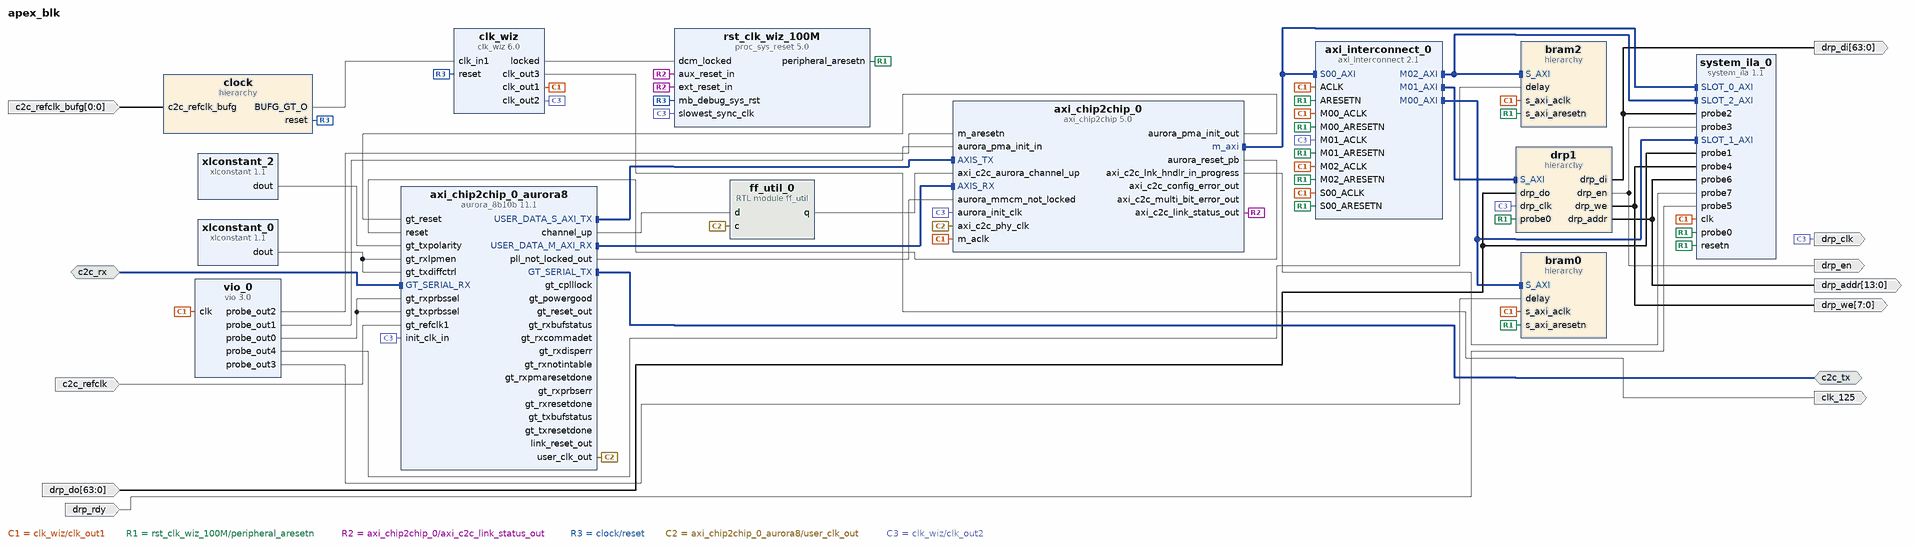
[diagram p0: block diagram of the top level]
# Vivado block design apex_blk, xcku15p-ffva1760-2-e, Vivado 2020.1
create_bd_design apex_blk

create_bd_intf_port -mode Master -vlnv xilinx.com:display_aurora:GT_Serial_Transceiver_Pins_TX_rtl:1.0 c2c_tx
create_bd_intf_port -mode Slave -vlnv xilinx.com:display_aurora:GT_Serial_Transceiver_Pins_RX_rtl:1.0 c2c_rx
create_bd_port -dir O -type clk drp_clk
create_bd_port -dir I -type clk c2c_refclk
set_property -dict {CONFIG.FREQ_HZ 250000000} [get_bd_ports c2c_refclk]
create_bd_port -dir I -from 0 -to 0 -type clk c2c_refclk_bufg
set_property -dict {CONFIG.FREQ_HZ 250000000} [get_bd_ports c2c_refclk_bufg]
create_bd_port -dir I -from 63 -to 0 drp_do
create_bd_port -dir O -from 63 -to 0 drp_di
create_bd_port -dir O drp_en
create_bd_port -dir O -from 7 -to 0 drp_we
create_bd_port -dir I drp_rdy
create_bd_port -dir O -from 13 -to 0 drp_addr
create_bd_port -dir O -type clk clk_125
set_property -dict {CONFIG.FREQ_HZ 125000000} [get_bd_ports clk_125]

create_bd_cell -type ip -vlnv xilinx.com:ip:axi_interconnect:2.1 axi_interconnect_0
set_property -dict {CONFIG.NUM_MI 3} [get_bd_cells axi_interconnect_0]
create_bd_cell -type ip -vlnv xilinx.com:ip:axi_chip2chip:5.0 axi_chip2chip_0
set_property -dict [list \
  CONFIG.C_ECC_ENABLE false \
  CONFIG.C_EN_AXI_LINK_HNDLR true \
  CONFIG.C_INTERFACE_MODE 1 \
  CONFIG.C_INTERFACE_TYPE 3 \
  CONFIG.C_MASTER_FPGA 0 \
  CONFIG.C_M_AXI_WUSER_WIDTH 0 \
] [get_bd_cells axi_chip2chip_0]
create_bd_cell -type ip -vlnv xilinx.com:ip:aurora_8b10b:11.1 axi_chip2chip_0_aurora8
set_property -dict [list \
  CONFIG.CHANNEL_ENABLE X0Y12 \
  CONFIG.C_AURORA_LANES 1 \
  CONFIG.C_DRP_IF false \
  CONFIG.C_LANE_WIDTH 4 \
  CONFIG.C_LINE_RATE 3.75 \
  CONFIG.C_REFCLK_FREQUENCY 250 \
  CONFIG.C_REFCLK_SOURCE {MGTREFCLK0 of Quad X0Y3} \
  CONFIG.C_START_LANE X0Y12 \
  CONFIG.C_START_QUAD Quad_X0Y3 \
  CONFIG.Interface_Mode Streaming \
  CONFIG.RX_EQ_MODE LPM \
  CONFIG.SINGLEEND_GTREFCLK true \
  CONFIG.SupportLevel 1 \
  CONFIG.TransceiverControl true \
] [get_bd_cells axi_chip2chip_0_aurora8]
create_bd_cell -type ip -vlnv xilinx.com:ip:vio:3.0 vio_0
set_property -dict [list \
  CONFIG.C_NUM_PROBE_IN 0 \
  CONFIG.C_NUM_PROBE_OUT 5 \
  CONFIG.C_PROBE_OUT0_WIDTH 4 \
  CONFIG.C_PROBE_OUT2_INIT_VAL 0x1 \
  CONFIG.C_PROBE_OUT3_INIT_VAL 0x11 \
  CONFIG.C_PROBE_OUT3_WIDTH 7 \
  CONFIG.C_PROBE_OUT4_INIT_VAL 0x61 \
  CONFIG.C_PROBE_OUT4_WIDTH 7 \
] [get_bd_cells vio_0]
create_bd_cell -type ip -vlnv xilinx.com:ip:proc_sys_reset:5.0 rst_clk_wiz_100M
create_bd_cell -type ip -vlnv xilinx.com:ip:xlconstant:1.1 xlconstant_2
set_property -dict {CONFIG.CONST_VAL 0} [get_bd_cells xlconstant_2]
create_bd_cell -type module -reference ff_util ff_util_0
create_bd_cell -type ip -vlnv xilinx.com:ip:xlconstant:1.1 xlconstant_0
set_property -dict {CONFIG.CONST_VAL 31 CONFIG.CONST_WIDTH 5} [get_bd_cells xlconstant_0]
create_bd_cell -type hier bram0
create_bd_cell -type hier bram2
create_bd_cell -type hier drp1
create_bd_cell -type hier clock
create_bd_cell -type ip -vlnv xilinx.com:ip:clk_wiz:6.0 clk_wiz
set_property -dict [list \
  CONFIG.CLKIN1_JITTER_PS 40.0 \
  CONFIG.CLKOUT1_JITTER 102.484 \
  CONFIG.CLKOUT1_PHASE_ERROR 79.008 \
  CONFIG.CLKOUT2_JITTER 117.522 \
  CONFIG.CLKOUT2_PHASE_ERROR 79.008 \
  CONFIG.CLKOUT2_REQUESTED_OUT_FREQ 50 \
  CONFIG.CLKOUT2_USED true \
  CONFIG.CLKOUT3_JITTER 98.122 \
  CONFIG.CLKOUT3_PHASE_ERROR 79.008 \
  CONFIG.CLKOUT3_REQUESTED_OUT_FREQ 125.000 \
  CONFIG.CLKOUT3_USED true \
  CONFIG.MMCM_CLKFBOUT_MULT_F 5.000 \
  CONFIG.MMCM_CLKIN1_PERIOD 4.000 \
  CONFIG.MMCM_CLKOUT0_DIVIDE_F 12.500 \
  CONFIG.MMCM_CLKOUT1_DIVIDE 25 \
  CONFIG.MMCM_CLKOUT2_DIVIDE 10 \
  CONFIG.MMCM_DIVCLK_DIVIDE 1 \
  CONFIG.NUM_OUT_CLKS 3 \
  CONFIG.PRIM_IN_FREQ 250 \
] [get_bd_cells clk_wiz]
create_bd_cell -type ip -vlnv xilinx.com:ip:system_ila:1.1 system_ila_0
set_property -dict [list \
  CONFIG.C_INPUT_PIPE_STAGES 6 \
  CONFIG.C_MON_TYPE MIX \
  CONFIG.C_NUM_MONITOR_SLOTS 3 \
  CONFIG.C_NUM_OF_PROBES 8 \
] [get_bd_cells system_ila_0]

# ---- hierarchy /bram0 ----
current_bd_instance /bram0
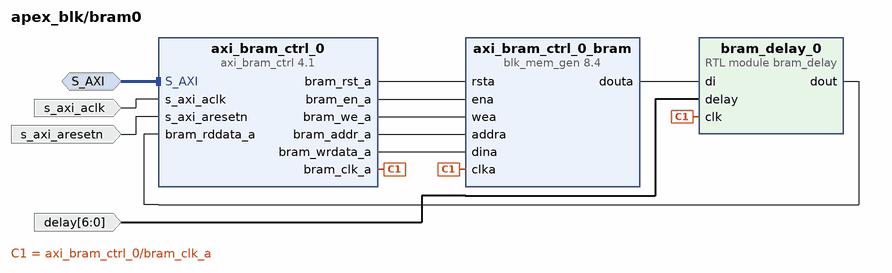
[diagram p1: block diagram inside /bram0]
create_bd_intf_pin -mode Slave -vlnv xilinx.com:interface:aximm_rtl:1.0 S_AXI
create_bd_pin -dir I -type clk s_axi_aclk
create_bd_pin -dir I -type rst s_axi_aresetn
create_bd_pin -dir I -from 6 -to 0 delay

create_bd_cell -type ip -vlnv xilinx.com:ip:axi_bram_ctrl:4.1 axi_bram_ctrl_0
set_property -dict {CONFIG.READ_LATENCY 20 CONFIG.SINGLE_PORT_BRAM 1} [get_bd_cells axi_bram_ctrl_0]
create_bd_cell -type module -reference bram_delay bram_delay_0
create_bd_cell -type ip -vlnv xilinx.com:ip:blk_mem_gen:8.4 axi_bram_ctrl_0_bram
set_property -dict [list \
  CONFIG.Memory_Type Single_Port_RAM \
  CONFIG.Port_B_Clock 0 \
  CONFIG.Port_B_Enable_Rate 0 \
  CONFIG.Port_B_Write_Rate 0 \
] [get_bd_cells axi_bram_ctrl_0_bram]

# ---- hierarchy /bram2 ----
current_bd_instance /bram2
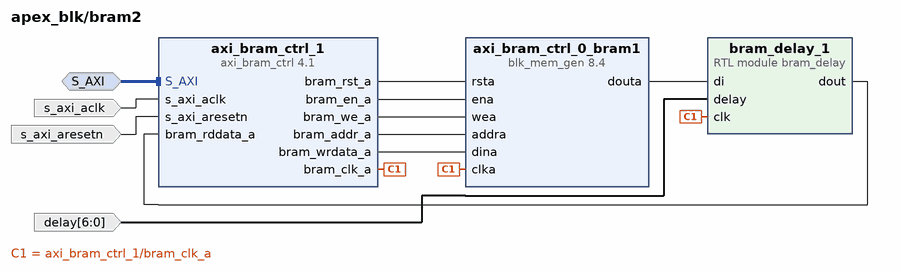
[diagram p2: block diagram inside /bram2]
create_bd_intf_pin -mode Slave -vlnv xilinx.com:interface:aximm_rtl:1.0 S_AXI
create_bd_pin -dir I -type clk s_axi_aclk
create_bd_pin -dir I -type rst s_axi_aresetn
create_bd_pin -dir I -from 6 -to 0 delay

create_bd_cell -type ip -vlnv xilinx.com:ip:axi_bram_ctrl:4.1 axi_bram_ctrl_1
set_property -dict {CONFIG.READ_LATENCY 100 CONFIG.SINGLE_PORT_BRAM 1} [get_bd_cells axi_bram_ctrl_1]
create_bd_cell -type module -reference bram_delay bram_delay_1
create_bd_cell -type ip -vlnv xilinx.com:ip:blk_mem_gen:8.4 axi_bram_ctrl_0_bram1

# ---- hierarchy /drp1 ----
current_bd_instance /drp1
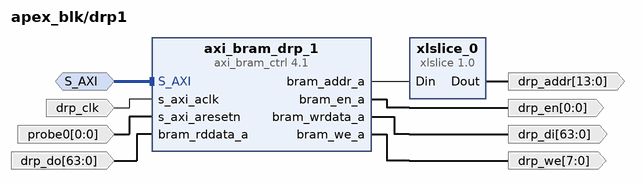
[diagram p3: block diagram inside /drp1]
create_bd_intf_pin -mode Slave -vlnv xilinx.com:interface:aximm_rtl:1.0 S_AXI
create_bd_pin -dir I -type clk drp_clk
create_bd_pin -dir I -from 0 -to 0 probe0
create_bd_pin -dir O -from 0 -to 0 drp_en
create_bd_pin -dir O -from 7 -to 0 drp_we
create_bd_pin -dir O -from 13 -to 0 drp_addr
create_bd_pin -dir O -from 63 -to 0 drp_di
create_bd_pin -dir I -from 63 -to 0 drp_do

create_bd_cell -type ip -vlnv xilinx.com:ip:axi_bram_ctrl:4.1 axi_bram_drp_1
set_property -dict {CONFIG.DATA_WIDTH 64 CONFIG.READ_LATENCY 20 CONFIG.SINGLE_PORT_BRAM 1} [get_bd_cells axi_bram_drp_1]
create_bd_cell -type ip -vlnv xilinx.com:ip:xlslice:1.0 xlslice_0
set_property -dict {CONFIG.DIN_FROM 16 CONFIG.DIN_TO 3 CONFIG.DIN_WIDTH 17 CONFIG.DOUT_WIDTH 14} [get_bd_cells xlslice_0]

# ---- hierarchy /clock ----
current_bd_instance /clock
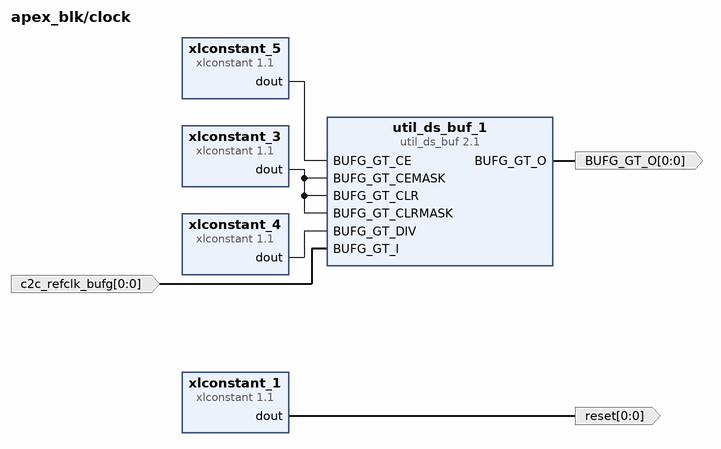
[diagram p4: block diagram inside /clock]
create_bd_pin -dir I -from 0 -to 0 -type clk c2c_refclk_bufg
create_bd_pin -dir O -from 0 -to 0 -type rst reset
create_bd_pin -dir O -from 0 -to 0 -type clk BUFG_GT_O

create_bd_cell -type ip -vlnv xilinx.com:ip:util_ds_buf:2.1 util_ds_buf_1
set_property -dict {CONFIG.C_BUF_TYPE BUFG_GT} [get_bd_cells util_ds_buf_1]
create_bd_cell -type ip -vlnv xilinx.com:ip:xlconstant:1.1 xlconstant_1
set_property -dict {CONFIG.CONST_VAL 0} [get_bd_cells xlconstant_1]
create_bd_cell -type ip -vlnv xilinx.com:ip:xlconstant:1.1 xlconstant_3
set_property -dict {CONFIG.CONST_VAL 0} [get_bd_cells xlconstant_3]
create_bd_cell -type ip -vlnv xilinx.com:ip:xlconstant:1.1 xlconstant_4
set_property -dict {CONFIG.CONST_VAL 0 CONFIG.CONST_WIDTH 3} [get_bd_cells xlconstant_4]
create_bd_cell -type ip -vlnv xilinx.com:ip:xlconstant:1.1 xlconstant_5

# ---- connections ----

current_bd_instance /bram0
connect_bd_intf_net -intf_net axi_interconnect_0_M00_AXI [get_bd_intf_pins S_AXI] [get_bd_intf_pins axi_bram_ctrl_0/S_AXI]
connect_bd_net [get_bd_pins axi_bram_ctrl_0/bram_rst_a] [get_bd_pins axi_bram_ctrl_0_bram/rsta]
connect_bd_net [get_bd_pins axi_bram_ctrl_0/bram_clk_a] [get_bd_pins axi_bram_ctrl_0_bram/clka] [get_bd_pins bram_delay_0/clk]
connect_bd_net [get_bd_pins axi_bram_ctrl_0/bram_en_a] [get_bd_pins axi_bram_ctrl_0_bram/ena]
connect_bd_net [get_bd_pins axi_bram_ctrl_0/bram_we_a] [get_bd_pins axi_bram_ctrl_0_bram/wea]
connect_bd_net [get_bd_pins axi_bram_ctrl_0/bram_addr_a] [get_bd_pins axi_bram_ctrl_0_bram/addra]
connect_bd_net [get_bd_pins axi_bram_ctrl_0/bram_wrdata_a] [get_bd_pins axi_bram_ctrl_0_bram/dina]
connect_bd_net [get_bd_pins bram_delay_0/dout] [get_bd_pins axi_bram_ctrl_0/bram_rddata_a]
connect_bd_net [get_bd_pins axi_bram_ctrl_0_bram/douta] [get_bd_pins bram_delay_0/di]
connect_bd_net -net clk_wiz_clk_out1 [get_bd_pins s_axi_aclk] [get_bd_pins axi_bram_ctrl_0/s_axi_aclk]
connect_bd_net -net rst_clk_wiz_100M_peripheral_aresetn [get_bd_pins s_axi_aresetn] [get_bd_pins axi_bram_ctrl_0/s_axi_aresetn]
connect_bd_net -net vio_0_probe_out3 [get_bd_pins delay] [get_bd_pins bram_delay_0/delay]

current_bd_instance /bram2
connect_bd_intf_net -intf_net axi_interconnect_0_M02_AXI [get_bd_intf_pins S_AXI] [get_bd_intf_pins axi_bram_ctrl_1/S_AXI]
connect_bd_net [get_bd_pins axi_bram_ctrl_1/bram_rst_a] [get_bd_pins axi_bram_ctrl_0_bram1/rsta]
connect_bd_net [get_bd_pins axi_bram_ctrl_1/bram_clk_a] [get_bd_pins axi_bram_ctrl_0_bram1/clka] [get_bd_pins bram_delay_1/clk]
connect_bd_net [get_bd_pins axi_bram_ctrl_1/bram_en_a] [get_bd_pins axi_bram_ctrl_0_bram1/ena]
connect_bd_net [get_bd_pins axi_bram_ctrl_1/bram_we_a] [get_bd_pins axi_bram_ctrl_0_bram1/wea]
connect_bd_net [get_bd_pins axi_bram_ctrl_1/bram_addr_a] [get_bd_pins axi_bram_ctrl_0_bram1/addra]
connect_bd_net [get_bd_pins axi_bram_ctrl_1/bram_wrdata_a] [get_bd_pins axi_bram_ctrl_0_bram1/dina]
connect_bd_net [get_bd_pins bram_delay_1/dout] [get_bd_pins axi_bram_ctrl_1/bram_rddata_a]
connect_bd_net [get_bd_pins axi_bram_ctrl_0_bram1/douta] [get_bd_pins bram_delay_1/di]
connect_bd_net -net clk_wiz_clk_out1 [get_bd_pins s_axi_aclk] [get_bd_pins axi_bram_ctrl_1/s_axi_aclk]
connect_bd_net -net rst_clk_wiz_100M_peripheral_aresetn [get_bd_pins s_axi_aresetn] [get_bd_pins axi_bram_ctrl_1/s_axi_aresetn]
connect_bd_net -net vio_0_probe_out4 [get_bd_pins delay] [get_bd_pins bram_delay_1/delay]

current_bd_instance /drp1
connect_bd_intf_net -intf_net axi_interconnect_0_M01_AXI [get_bd_intf_pins S_AXI] [get_bd_intf_pins axi_bram_drp_1/S_AXI]
connect_bd_net [get_bd_pins drp_clk] [get_bd_pins axi_bram_drp_1/s_axi_aclk]
connect_bd_net -net rst_clk_wiz_100M_peripheral_aresetn [get_bd_pins probe0] [get_bd_pins axi_bram_drp_1/s_axi_aresetn]
connect_bd_net -net drp_bridge_0_drp0_en [get_bd_pins axi_bram_drp_1/bram_en_a] [get_bd_pins drp_en]
connect_bd_net -net drp_bridge_0_drp0_we [get_bd_pins axi_bram_drp_1/bram_we_a] [get_bd_pins drp_we]
connect_bd_net -net drp_bridge_0_drp0_di [get_bd_pins axi_bram_drp_1/bram_wrdata_a] [get_bd_pins drp_di]
connect_bd_net [get_bd_pins drp_do] [get_bd_pins axi_bram_drp_1/bram_rddata_a]
connect_bd_net [get_bd_pins axi_bram_drp_1/bram_addr_a] [get_bd_pins xlslice_0/Din]
connect_bd_net [get_bd_pins xlslice_0/Dout] [get_bd_pins drp_addr]

current_bd_instance /clock
connect_bd_net -net xlconstant_2_dout [get_bd_pins xlconstant_5/dout] [get_bd_pins util_ds_buf_1/BUFG_GT_CE]
connect_bd_net [get_bd_pins xlconstant_3/dout] \
  [get_bd_pins util_ds_buf_1/BUFG_GT_CEMASK] [get_bd_pins util_ds_buf_1/BUFG_GT_CLR] \
  [get_bd_pins util_ds_buf_1/BUFG_GT_CLRMASK]
connect_bd_net [get_bd_pins xlconstant_4/dout] [get_bd_pins util_ds_buf_1/BUFG_GT_DIV]
connect_bd_net -net BUFG_GT_I_0_1 [get_bd_pins c2c_refclk_bufg] [get_bd_pins util_ds_buf_1/BUFG_GT_I]
connect_bd_net [get_bd_pins xlconstant_1/dout] [get_bd_pins reset]
connect_bd_net [get_bd_pins util_ds_buf_1/BUFG_GT_O] [get_bd_pins BUFG_GT_O]

current_bd_instance /
connect_bd_intf_net [get_bd_intf_ports c2c_tx] [get_bd_intf_pins axi_chip2chip_0_aurora8/GT_SERIAL_TX]
connect_bd_intf_net [get_bd_intf_pins axi_chip2chip_0_aurora8/USER_DATA_S_AXI_TX] [get_bd_intf_pins axi_chip2chip_0/AXIS_TX]
connect_bd_intf_net [get_bd_intf_pins axi_chip2chip_0_aurora8/USER_DATA_M_AXI_RX] [get_bd_intf_pins axi_chip2chip_0/AXIS_RX]
connect_bd_intf_net [get_bd_intf_pins axi_interconnect_0/M02_AXI] [get_bd_intf_pins bram2/S_AXI]
connect_bd_intf_net [get_bd_intf_pins axi_interconnect_0/M02_AXI] [get_bd_intf_pins system_ila_0/SLOT_2_AXI]
connect_bd_intf_net [get_bd_intf_ports c2c_rx] [get_bd_intf_pins axi_chip2chip_0_aurora8/GT_SERIAL_RX]
connect_bd_intf_net [get_bd_intf_pins axi_interconnect_0/S00_AXI] [get_bd_intf_pins axi_chip2chip_0/m_axi]
connect_bd_intf_net [get_bd_intf_pins axi_interconnect_0/S00_AXI] [get_bd_intf_pins system_ila_0/SLOT_0_AXI]
connect_bd_intf_net [get_bd_intf_pins axi_interconnect_0/M00_AXI] [get_bd_intf_pins bram0/S_AXI]
connect_bd_intf_net [get_bd_intf_pins axi_interconnect_0/M00_AXI] [get_bd_intf_pins system_ila_0/SLOT_1_AXI]
connect_bd_intf_net [get_bd_intf_pins axi_interconnect_0/M01_AXI] [get_bd_intf_pins drp1/S_AXI]
connect_bd_net [get_bd_pins clk_wiz/clk_out1] \
  [get_bd_pins axi_interconnect_0/S00_ACLK] [get_bd_pins axi_interconnect_0/M00_ACLK] [get_bd_pins axi_interconnect_0/ACLK] \
  [get_bd_pins axi_interconnect_0/M02_ACLK] [get_bd_pins vio_0/clk] [get_bd_pins axi_chip2chip_0/m_aclk] \
  [get_bd_pins bram0/s_axi_aclk] [get_bd_pins bram2/s_axi_aclk] [get_bd_pins system_ila_0/clk]
connect_bd_net [get_bd_pins rst_clk_wiz_100M/peripheral_aresetn] \
  [get_bd_pins axi_interconnect_0/S00_ARESETN] [get_bd_pins axi_interconnect_0/M00_ARESETN] \
  [get_bd_pins axi_interconnect_0/ARESETN] [get_bd_pins axi_interconnect_0/M01_ARESETN] \
  [get_bd_pins axi_interconnect_0/M02_ARESETN] [get_bd_pins bram0/s_axi_aresetn] [get_bd_pins bram2/s_axi_aresetn] \
  [get_bd_pins drp1/probe0] [get_bd_pins system_ila_0/resetn] [get_bd_pins system_ila_0/probe0]
# net gt_rxprbserr has one end: axi_chip2chip_0_aurora8/gt_rxprbserr
# net axi_c2c_config_error_out has one end: axi_chip2chip_0/axi_c2c_config_error_out
connect_bd_net -net axi_c2c_link_status_out [get_bd_pins axi_chip2chip_0/axi_c2c_link_status_out] \
  [get_bd_pins rst_clk_wiz_100M/ext_reset_in] [get_bd_pins rst_clk_wiz_100M/aux_reset_in]
# net axi_c2c_multi_bit_error_out has one end: axi_chip2chip_0/axi_c2c_multi_bit_error_out
# net gt_cplllock has one end: axi_chip2chip_0_aurora8/gt_cplllock
# net gt_rxcommadet has one end: axi_chip2chip_0_aurora8/gt_rxcommadet
# net gt_reset_out has one end: axi_chip2chip_0_aurora8/gt_reset_out
# net gt_powergood has one end: axi_chip2chip_0_aurora8/gt_powergood
# net link_reset_out has one end: axi_chip2chip_0_aurora8/link_reset_out
connect_bd_net -net gt_refclk1_0_1 [get_bd_ports c2c_refclk] [get_bd_pins axi_chip2chip_0_aurora8/gt_refclk1]
connect_bd_net -net BUFG_GT_I_0_1 [get_bd_ports c2c_refclk_bufg] [get_bd_pins clock/c2c_refclk_bufg]
connect_bd_net -net drp_bridge_0_drp0_di [get_bd_pins drp1/drp_di] [get_bd_ports drp_di] [get_bd_pins system_ila_0/probe2]
connect_bd_net -net drp_bridge_0_drp0_en [get_bd_pins drp1/drp_en] [get_bd_ports drp_en] [get_bd_pins system_ila_0/probe3]
connect_bd_net -net drp_bridge_0_drp0_we [get_bd_pins drp1/drp_we] [get_bd_ports drp_we] [get_bd_pins system_ila_0/probe4]
connect_bd_net -net drp_bridge_0_drp0_addr [get_bd_pins drp1/drp_addr] [get_bd_ports drp_addr] [get_bd_pins system_ila_0/probe6]
connect_bd_net -net xlconstant_1_dout [get_bd_pins clock/reset] [get_bd_pins rst_clk_wiz_100M/mb_debug_sys_rst] [get_bd_pins clk_wiz/reset]
connect_bd_net [get_bd_pins vio_0/probe_out2] [get_bd_pins axi_chip2chip_0/m_aresetn]
connect_bd_net [get_bd_pins axi_chip2chip_0_aurora8/user_clk_out] [get_bd_pins axi_chip2chip_0/axi_c2c_phy_clk] [get_bd_pins ff_util_0/c]
connect_bd_net -net vio_0_probe_out1 [get_bd_pins vio_0/probe_out1] [get_bd_pins axi_chip2chip_0/aurora_pma_init_in]
connect_bd_net [get_bd_pins clk_wiz/clk_out2] \
  [get_bd_pins axi_chip2chip_0_aurora8/init_clk_in] [get_bd_pins axi_chip2chip_0/aurora_init_clk] \
  [get_bd_pins axi_interconnect_0/M01_ACLK] [get_bd_pins rst_clk_wiz_100M/slowest_sync_clk] [get_bd_ports drp_clk] \
  [get_bd_pins drp1/drp_clk]
connect_bd_net -net axi_chip2chip_0_aurora_pma_init_out [get_bd_pins axi_chip2chip_0/aurora_pma_init_out] \
  [get_bd_pins axi_chip2chip_0_aurora8/gt_reset]
connect_bd_net -net axi_chip2chip_0_aurora8_pll_not_locked_out [get_bd_pins axi_chip2chip_0_aurora8/pll_not_locked_out] \
  [get_bd_pins axi_chip2chip_0/aurora_mmcm_not_locked]
connect_bd_net -net axi_chip2chip_0_aurora_reset_pb [get_bd_pins axi_chip2chip_0/aurora_reset_pb] [get_bd_pins axi_chip2chip_0_aurora8/reset]
connect_bd_net -net vio_0_probe_out0 [get_bd_pins vio_0/probe_out0] \
  [get_bd_pins axi_chip2chip_0_aurora8/gt_rxprbssel] [get_bd_pins axi_chip2chip_0_aurora8/gt_txprbssel]
connect_bd_net -net c2c_dout [get_bd_pins xlconstant_2/dout] [get_bd_pins axi_chip2chip_0_aurora8/gt_txpolarity]
connect_bd_net [get_bd_ports drp_do] [get_bd_pins drp1/drp_do] [get_bd_pins system_ila_0/probe1]
# net gt_rxbufstatus has one end: axi_chip2chip_0_aurora8/gt_rxbufstatus
# net gt_rxdisperr has one end: axi_chip2chip_0_aurora8/gt_rxdisperr
# net gt_rxnotintable has one end: axi_chip2chip_0_aurora8/gt_rxnotintable
# net gt_rxpmaresetdone has one end: axi_chip2chip_0_aurora8/gt_rxpmaresetdone
# net gt_rxresetdone has one end: axi_chip2chip_0_aurora8/gt_rxresetdone
# net gt_txbufstatus has one end: axi_chip2chip_0_aurora8/gt_txbufstatus
# net gt_txresetdone has one end: axi_chip2chip_0_aurora8/gt_txresetdone
connect_bd_net [get_bd_pins axi_chip2chip_0_aurora8/channel_up] [get_bd_pins ff_util_0/d]
connect_bd_net [get_bd_pins ff_util_0/q] [get_bd_pins axi_chip2chip_0/axi_c2c_aurora_channel_up]
connect_bd_net [get_bd_pins xlconstant_0/dout] [get_bd_pins axi_chip2chip_0_aurora8/gt_txdiffctrl] [get_bd_pins axi_chip2chip_0_aurora8/gt_rxlpmen]
connect_bd_net [get_bd_pins vio_0/probe_out3] [get_bd_pins bram0/delay]
connect_bd_net [get_bd_pins vio_0/probe_out4] [get_bd_pins bram2/delay]
connect_bd_net [get_bd_pins clock/BUFG_GT_O] [get_bd_pins clk_wiz/clk_in1]
connect_bd_net [get_bd_pins clk_wiz/locked] [get_bd_pins rst_clk_wiz_100M/dcm_locked]
connect_bd_net [get_bd_ports drp_rdy] [get_bd_pins system_ila_0/probe5]
connect_bd_net [get_bd_pins axi_chip2chip_0/axi_c2c_lnk_hndlr_in_progress] [get_bd_pins system_ila_0/probe7]
connect_bd_net [get_bd_pins clk_wiz/clk_out3] [get_bd_ports clk_125]
set_property HDL_ATTRIBUTE.DEBUG true [get_bd_nets gt_rxprbserr]
set_property HDL_ATTRIBUTE.MARK_DEBUG true [get_bd_nets gt_rxprbserr]
set_property HDL_ATTRIBUTE.DEBUG true [get_bd_nets axi_c2c_config_error_out]
set_property HDL_ATTRIBUTE.MARK_DEBUG true [get_bd_nets axi_c2c_config_error_out]
set_property HDL_ATTRIBUTE.DEBUG true [get_bd_nets axi_c2c_link_status_out]
set_property HDL_ATTRIBUTE.MARK_DEBUG true [get_bd_nets axi_c2c_link_status_out]
set_property HDL_ATTRIBUTE.DEBUG true [get_bd_nets axi_c2c_multi_bit_error_out]
set_property HDL_ATTRIBUTE.MARK_DEBUG true [get_bd_nets axi_c2c_multi_bit_error_out]
set_property HDL_ATTRIBUTE.DEBUG true [get_bd_nets gt_cplllock]
set_property HDL_ATTRIBUTE.MARK_DEBUG true [get_bd_nets gt_cplllock]
set_property HDL_ATTRIBUTE.DEBUG true [get_bd_nets gt_rxcommadet]
set_property HDL_ATTRIBUTE.MARK_DEBUG true [get_bd_nets gt_rxcommadet]
set_property HDL_ATTRIBUTE.DEBUG true [get_bd_nets gt_reset_out]
set_property HDL_ATTRIBUTE.MARK_DEBUG true [get_bd_nets gt_reset_out]
set_property HDL_ATTRIBUTE.DEBUG true [get_bd_nets gt_powergood]
set_property HDL_ATTRIBUTE.MARK_DEBUG true [get_bd_nets gt_powergood]
set_property HDL_ATTRIBUTE.DEBUG true [get_bd_nets link_reset_out]
set_property HDL_ATTRIBUTE.MARK_DEBUG true [get_bd_nets link_reset_out]
set_property HDL_ATTRIBUTE.DEBUG true [get_bd_nets vio_0_probe_out1]
set_property HDL_ATTRIBUTE.MARK_DEBUG true [get_bd_nets vio_0_probe_out1]
set_property HDL_ATTRIBUTE.DEBUG true [get_bd_nets axi_chip2chip_0_aurora_pma_init_out]
set_property HDL_ATTRIBUTE.MARK_DEBUG true [get_bd_nets axi_chip2chip_0_aurora_pma_init_out]
set_property HDL_ATTRIBUTE.DEBUG true [get_bd_nets axi_chip2chip_0_aurora8_pll_not_locked_out]
set_property HDL_ATTRIBUTE.MARK_DEBUG true [get_bd_nets axi_chip2chip_0_aurora8_pll_not_locked_out]
set_property HDL_ATTRIBUTE.DEBUG true [get_bd_nets axi_chip2chip_0_aurora_reset_pb]
set_property HDL_ATTRIBUTE.MARK_DEBUG true [get_bd_nets axi_chip2chip_0_aurora_reset_pb]
set_property HDL_ATTRIBUTE.DEBUG true [get_bd_nets vio_0_probe_out0]
set_property HDL_ATTRIBUTE.MARK_DEBUG true [get_bd_nets vio_0_probe_out0]
set_property HDL_ATTRIBUTE.DEBUG true [get_bd_nets gt_rxbufstatus]
set_property HDL_ATTRIBUTE.MARK_DEBUG true [get_bd_nets gt_rxbufstatus]
set_property HDL_ATTRIBUTE.DEBUG true [get_bd_nets gt_rxdisperr]
set_property HDL_ATTRIBUTE.MARK_DEBUG true [get_bd_nets gt_rxdisperr]
set_property HDL_ATTRIBUTE.DEBUG true [get_bd_nets gt_rxnotintable]
set_property HDL_ATTRIBUTE.MARK_DEBUG true [get_bd_nets gt_rxnotintable]
set_property HDL_ATTRIBUTE.DEBUG true [get_bd_nets gt_rxpmaresetdone]
set_property HDL_ATTRIBUTE.MARK_DEBUG true [get_bd_nets gt_rxpmaresetdone]
set_property HDL_ATTRIBUTE.DEBUG true [get_bd_nets gt_rxresetdone]
set_property HDL_ATTRIBUTE.MARK_DEBUG true [get_bd_nets gt_rxresetdone]
set_property HDL_ATTRIBUTE.DEBUG true [get_bd_nets gt_txbufstatus]
set_property HDL_ATTRIBUTE.MARK_DEBUG true [get_bd_nets gt_txbufstatus]
set_property HDL_ATTRIBUTE.DEBUG true [get_bd_nets gt_txresetdone]
set_property HDL_ATTRIBUTE.MARK_DEBUG true [get_bd_nets gt_txresetdone]

# ---- address map ----
assign_bd_address -offset 0x00000000 -range 64K -target_address_space [get_bd_addr_spaces axi_chip2chip_0/MAXI] [get_bd_addr_segs bram0/axi_bram_ctrl_0/S_AXI/Mem0]
assign_bd_address -offset 0x02000000 -range 64K -target_address_space [get_bd_addr_spaces axi_chip2chip_0/MAXI] [get_bd_addr_segs bram2/axi_bram_ctrl_1/S_AXI/Mem0]
assign_bd_address -offset 0x04000000 -range 128K -target_address_space [get_bd_addr_spaces axi_chip2chip_0/MAXI] [get_bd_addr_segs drp1/axi_bram_drp_1/S_AXI/Mem0]

validate_bd_design
save_bd_design
